# EAGLE schematic BQ25120_Battery_Mgmt_IC (EAGLE 9.2.2)
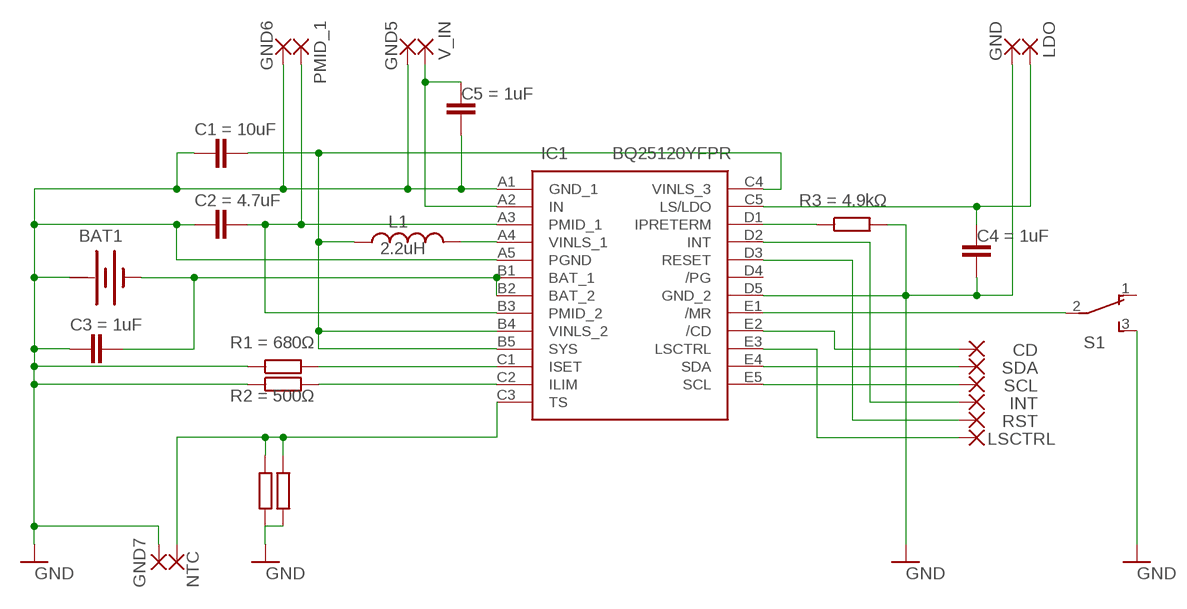
[diagram p0: schematic, sheet 1]
C1 (C): C2: 4.7uF
C2 (C): C3: 1uF
C3 (C): C4: 1uF
C4 (C): C1: 10uF
C5 (C): C5: 1uF
R3 (R): R3: 4.9kΩ
R4 (R): R2: 500Ω
R5 (R): R1: 680Ω

## Parts
BAT1  BATTERY  [BATTERY]
CD  SMD2  [SMD1,27-2,54]
GND  SMD2  [SMD1,27-2,54]
GND5  SMD2  [SMD1,27-2,54]
GND6  SMD2  [SMD1,27-2,54]
GND7  SMD2  [SMD1,27-2,54]
IC1  BQ25120YFPR  [BGA25C40P5X5_247X253X50]
INT  SMD2  [SMD1,27-2,54]
L1  L-USL2012C  [L2012C]
LDO  SMD2  [SMD1,27-2,54]
LSCTRL  SMD2  [SMD1,27-2,54]
NTC  SMD2  [SMD1,27-2,54]
PMID_1  SMD2  [SMD1,27-2,54]
RST  SMD2  [SMD1,27-2,54]
S1  TL36PO  [TL3XPO]
SCL  SMD2  [SMD1,27-2,54]
SDA  SMD2  [SMD1,27-2,54]
V_IN  SMD2  [SMD1,27-2,54]

## Nets
GND: BAT1.+ GND5.1(P) GND6.1(P) GND7.1(P) GND.1(P) IC1.A1(GND_1) IC1.A5(PGND) IC1.D5(GND_2) S1.3(S)
N$1: IC1.C1(ISET)
N$2: IC1.C2(ILIM)
N$3: IC1.A4(VINLS_1) L1.2
N$4: IC1.E1(/MR) S1.2(P)
N$5: BAT1.- IC1.B1(BAT_1) IC1.B2(BAT_2)
N$6: IC1.B4(VINLS_2) IC1.B5(SYS) IC1.C4(VINLS_3) L1.1
N$7: IC1.A2(IN) V_IN.1(P)
N$8: CD.1(P) IC1.E2(/CD)
N$9: IC1.E4(SDA) SDA.1(P)
N$10: IC1.E5(SCL) SCL.1(P)
N$11: IC1.D2(INT) INT.1(P)
N$12: IC1.D3(RESET) RST.1(P)
N$13: IC1.E3(LSCTRL) LSCTRL.1(P)
N$14: IC1.C5(LS/LDO) LDO.1(P)
N$15: IC1.C3(TS) NTC.1(P)
N$17: IC1.D1(IPRETERM)
N$18: IC1.A3(PMID_1) IC1.B3(PMID_2) PMID_1.1(P)
Unconnected: IC1.D4(/PG) S1.1(O)

## Power pins joined to a net without a drawn wire
+: BAT1.+@1(+)

## Library data of the parts
BAT1 = special:BATTERY: BATTERY
CD GND GND5-GND7 INT LDO LSCTRL NTC PMID_1 RST SCL SDA V_IN = wirepad:SMD2: SMD PAD
IC1 = BQ25120YFPR:BQ25120YFPR: Battery Management 700na Low Iq Battery Charge Mngt Source: Datasheet <https://www.arrow.com/en/products/bq25120yfpr/texas-instruments>; ARROW_PART_NUMBER: BQ25120YFPR; DESCRIPTION: Battery Management 700na Low Iq Battery Charge Mngt; HEIGHT: 0.5mm; MANUFACTURER_NAME: Texas Instruments; MANUFACTURER_PART_NUMBER: BQ25120YFPR
L1 = rcl:L-US: INDUCTOR, American symbol; SPICEPREFIX: 2.2uH
S1 = switch:TL36PO: TINY SWITCH ON - ON Source: http://www2.produktinfo.conrad.com/datenblaetter/700000-724999/705152-da-01-de-Subminiaturschalter_TL_36YO.pdf